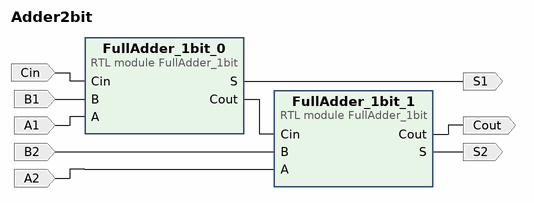
[diagram p0: block diagram of the top level]
# Vivado block design Adder2bit, xc7a200tfbg676-2, Vivado 2020.2
create_bd_design Adder2bit

create_bd_port -dir I -type data Cin
create_bd_port -dir I -type data A1
create_bd_port -dir I -type data A2
create_bd_port -dir I -type data B1
create_bd_port -dir I -type data B2
create_bd_port -dir O -type data S1
create_bd_port -dir O -type data S2
create_bd_port -dir O -type data Cout

create_bd_cell -type module -reference FullAdder_1bit FullAdder_1bit_0
create_bd_cell -type module -reference FullAdder_1bit FullAdder_1bit_1

# ---- connections ----

connect_bd_net [get_bd_pins FullAdder_1bit_0/Cout] [get_bd_pins FullAdder_1bit_1/Cin]
connect_bd_net [get_bd_ports Cin] [get_bd_pins FullAdder_1bit_0/Cin]
connect_bd_net [get_bd_pins FullAdder_1bit_0/S] [get_bd_ports S1]
connect_bd_net [get_bd_pins FullAdder_1bit_1/S] [get_bd_ports S2]
connect_bd_net -net B2_1 [get_bd_ports B2] [get_bd_pins FullAdder_1bit_1/B]
connect_bd_net -net B1_1 [get_bd_ports B1] [get_bd_pins FullAdder_1bit_0/B]
connect_bd_net -net A2_1 [get_bd_ports A2] [get_bd_pins FullAdder_1bit_1/A]
connect_bd_net -net A1_1 [get_bd_ports A1] [get_bd_pins FullAdder_1bit_0/A]
connect_bd_net [get_bd_pins FullAdder_1bit_1/Cout] [get_bd_ports Cout]

validate_bd_design
save_bd_design
